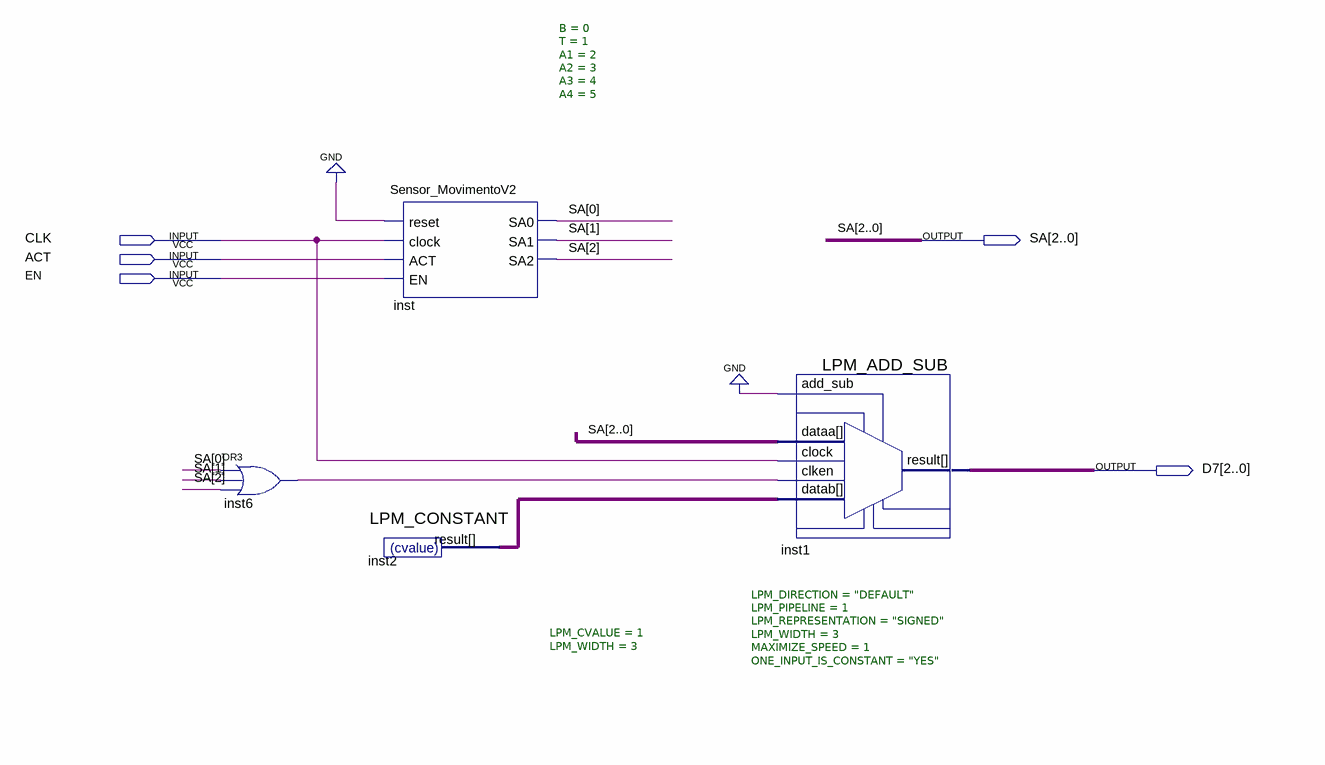
[diagram p0: schematic sheet]
// Quartus schematic Teste.bdf as structural Verilog: 4 symbols, 5 pins
module Teste (
  input  CLK,
  input  ACT,
  input  EN,
  output [2:0] SA,
  output [2:0] D7
);

  wire inst6_out;
  wire [2:0] inst2_result;

  or inst6 (inst6_out, SA[0], SA[1], SA[2]);
  LPM_CONSTANT #(.LPM_CVALUE(1), .LPM_WIDTH(3)) inst2 (.result(inst2_result));
  Sensor_MovimentoV2 #(.B(0), .T(1), .A1(2), .A2(3), .A3(4), .A4(5)) inst (
    .reset(1'b0), .clock(CLK), .ACT(ACT), .EN(EN), .SA0(SA[0]), .SA1(SA[1]), .SA2(SA[2]));
  LPM_ADD_SUB #(.LPM_DIRECTION("DEFAULT"), .LPM_PIPELINE(1), .LPM_REPRESENTATION("SIGNED"), .LPM_WIDTH(3), .MAXIMIZE_SPEED(1), .ONE_INPUT_IS_CONSTANT("YES")) inst1 (
    .add_sub(1'b0), .clken(inst6_out), .clock(CLK), .dataa(SA), .datab(inst2_result), .result(D7));
endmodule
